# EAGLE design Base_Station (EAGLE 6.5.0)
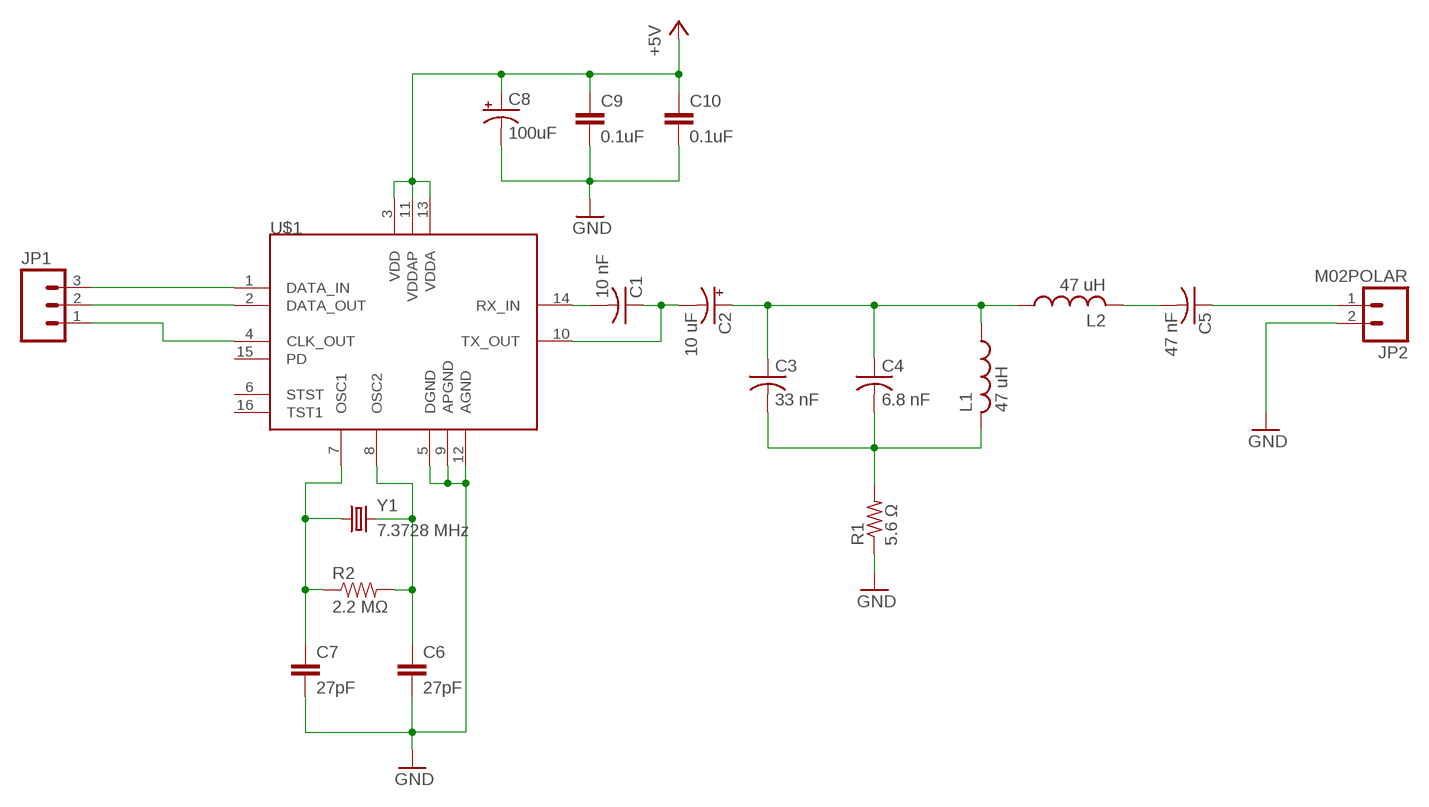
[diagram p0: schematic, sheet 1]

## Parts
C1  10 nF  C-US025-030X050  [C025-030X050]
C2  10 uF  CPOL-USE2-5  [E2-5]
C3  33 nF  C-US050-050X075  [C050-050X075]
C4  6.8 nF  C-US102-043X133  [C102-043X133]
C5  47 nF  C-US075-063X106  [C075-063X106]
C6  27pF  CAPPTH1  [CAP-PTH-5MM]
C7  27pF  CAPPTH1  [CAP-PTH-5MM]
C8  100uF  CAP_POLPTH1  [CPOL-RADIAL-100UF-25V]
C9  0.1uF  CAPPTH1  [CAP-PTH-5MM]
C10  0.1uF  CAPPTH1  [CAP-PTH-5MM]
JP1  M03POLAR  [MOLEX-1X3]
JP2  M02POLAR  [MOLEX-1X2]
L1  47 uH  L-US0204/7  [0204/7]
L2  47 uH  L-US0207/10  [0207/10]
R1  5.6 Ω  R-US_0207/7  [0207/7]
R2  2.2 MΩ  RESISTORPTH-1/4W  [AXIAL-0.4]
U$1  TDA5052AT  [SO16L]
Y1  7.3728 MHz  CRYSTALHC49US  [HC49US]

## Nets
+5V: C8.1(+) C9.1 C10.1 U$1.3(VDD) U$1.11(VDDAP) U$1.13(VDDA)
GND: C6.2 C7.2 C8.2(-) C9.2 C10.2 JP2.2 R1.1 U$1.5(DGND) U$1.9(APGND) U$1.12(AGND)
N$1: C1.2 U$1.14(RX_IN)
N$2: C5.2 L2.2
N$3: C1.1 C2.- U$1.10(TX_OUT)
N$4: C2.+ C3.1 C4.1 L1.1 L2.1
N$5: C3.2 C4.2 L1.2 R1.2
N$6: C5.1 JP2.1
N$7: C7.1 R2.P$1 U$1.7(OSC1) Y1.1
N$8: C6.1 R2.P$2 U$1.8(OSC2) Y1.2
N$9: JP1.3 U$1.1(DATA_IN)
N$10: JP1.2 U$1.2(DATA_OUT)
N$11: JP1.1 U$1.4(CLK_OUT)
Unconnected: U$1.6(STST) U$1.15(PD) U$1.16(TST1)

## Library data of the parts
C1 C3-C5 = rcl:C-US: CAPACITOR, American symbol
C2 = rcl:CPOL-US: POLARIZED CAPACITOR, American symbol
C6 C7 = SparkFun-Passives:CAP: Capacitor Standard 0603 ceramic capacitor, and 0.1" leaded capacitor.
C8 = SparkFun-Capacitors:CAP_POL: Capacitor Polarized These are standard SMD and PTH capacitors. Normally 10uF, 47uF, and 100uF in electrolytic and tantalum varieties. Always verify the external diameter of the through hole cap, it varies with capacity, voltage, and manufacturer. The EIA devices should be standard.
C9 C10 = SparkFun-Capacitors:CAP: Capacitor Standard 0603 ceramic capacitor, and 0.1" leaded capacitor.
JP1 = SparkFun-Connectors:M03: Header 3 Standard 3-pin 0.1" header. Use with straight break away headers (SKU : PRT-00116), right angle break away headers (PRT-00553), swiss pins (PRT-00743), machine pins (PRT-00117), and female headers (PRT-00115). Molex polarized connector foot print use with SKU : PRT-08232 with associated crimp pins and housings.
JP2 = SparkFun-Connectors:M02: Standard 2-pin 0.1" header. Use with - straight break away headers ( PRT-00116) - right angle break away headers (PRT-00553) - swiss pins (PRT-00743) - machine pins (PRT-00117) - female headers (PRT-00115) Molex polarized connector foot print use with: PRT-08233 with associated crimp pins and housings. 2.54_SCREWTERM for use with PRT-10571. 3.5mm Screw Terminal footprints for PRT-08084 5mm Screw Terminal footprints for use with PRT-08433
L1 L2 = rcl:L-US: INDUCTOR, American symbol
R1 = rcl:R-US_: RESISTOR, American symbol
R2 = SparkFun-Passives:RESISTOR: Resistor Basic schematic elements and footprints for 0603, 1206, and PTH resistors.
U$1 = Power_Modem:TDA5052AT
Y1 = SparkFun-FreqCtrl:CRYSTAL: Various standard crystals. Proven footprints. Spark Fun Electronics SKU : COM-00534

## Board
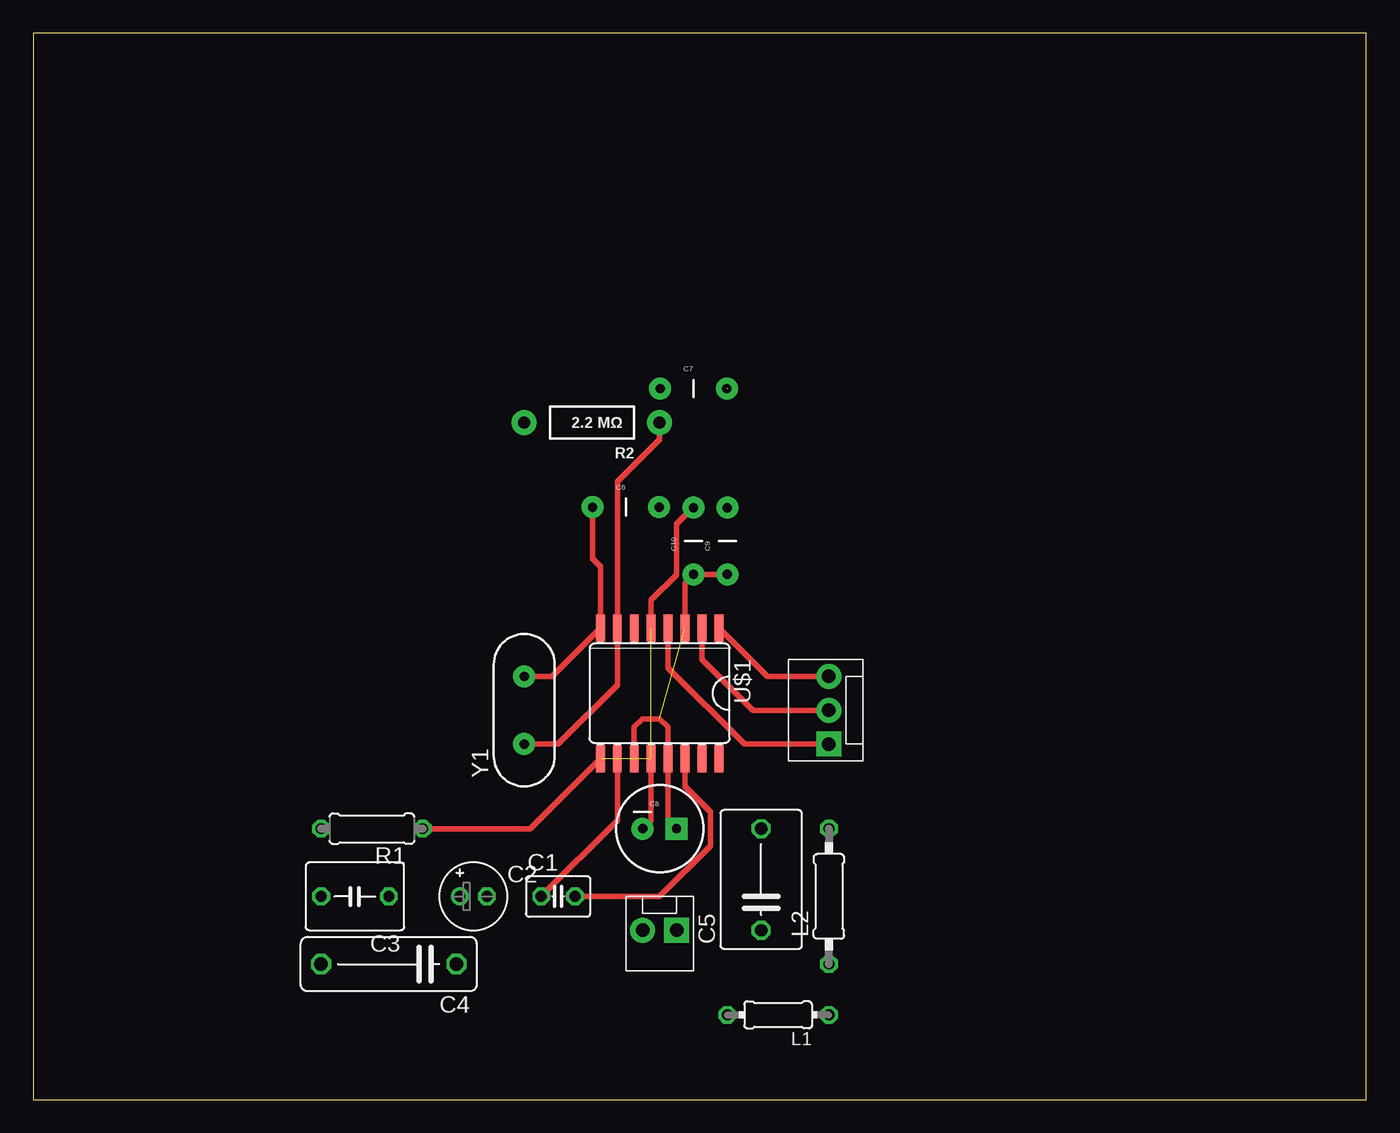
[diagram p1: board, top side]
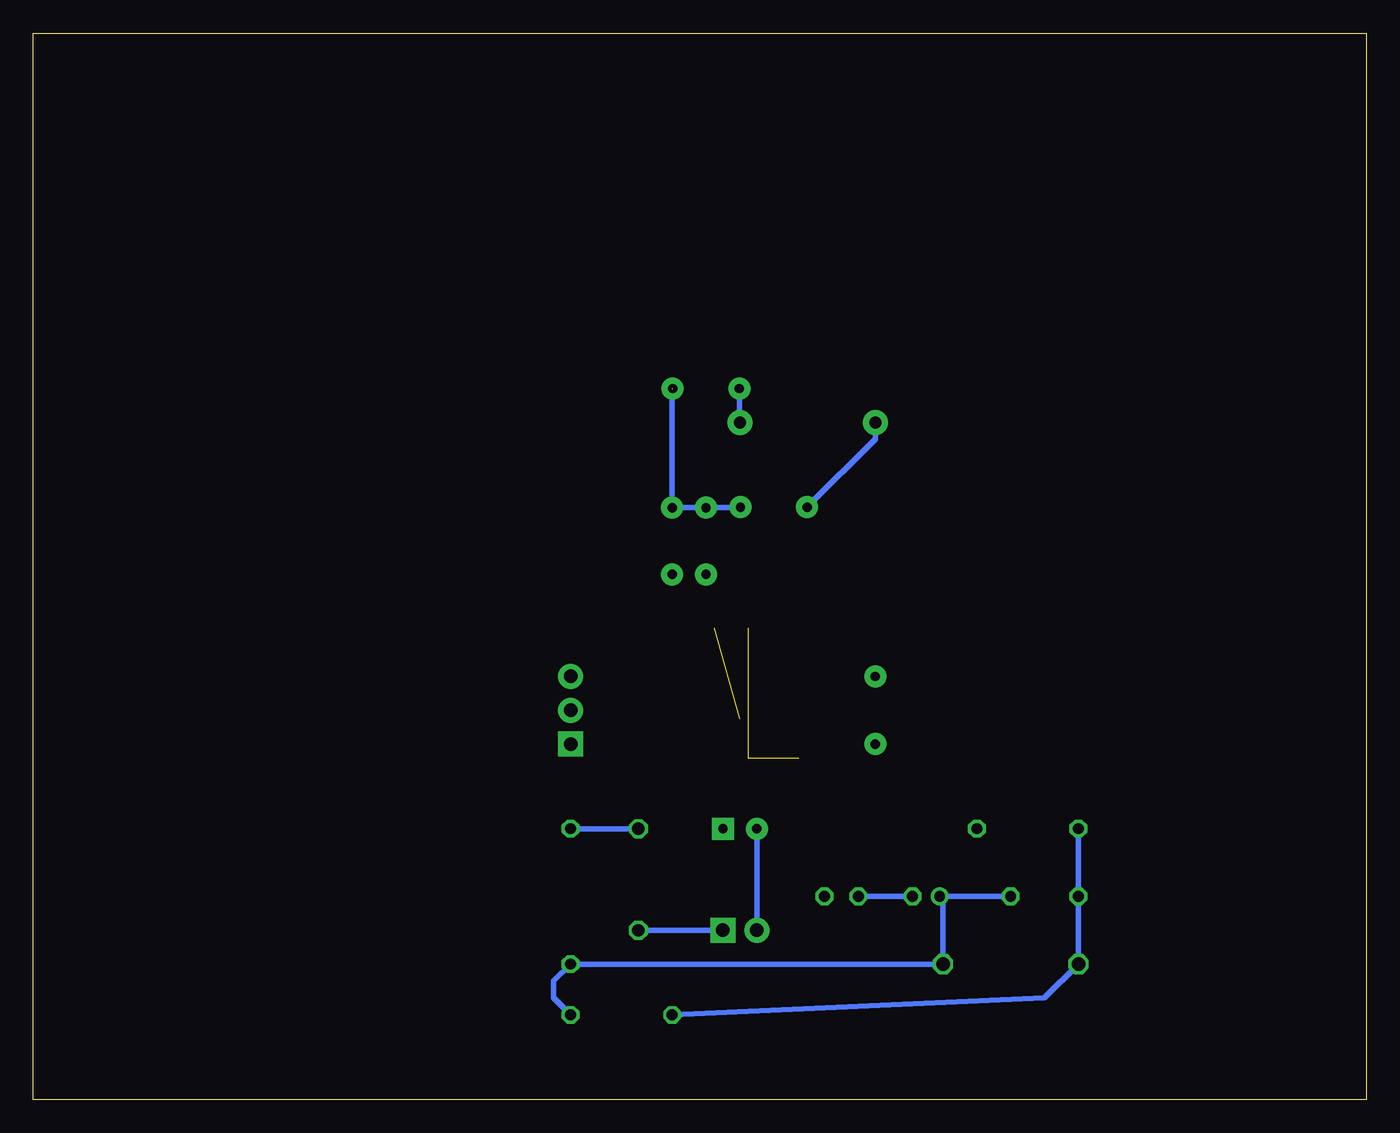
[diagram p2: board, bottom side, seen from below]

Size 100 x 80 mm. Coordinates in mm from the lower left corner, seen from the top.
Outline: 0,0 100,0 100,80 0,80 0,0
Copper layers (1*16): Top 0.035mm / dielectric 1.5mm / Bottom 0.035mm
Design rules "default": minimum track width 10mil, minimum drill 24mil, track to track 8mil, track to pad 8mil, pad to pad 8mil, via to via 8mil, smd to smd 8mil, copper to edge 40mil, drill to drill 8mil, minimum pad ring 10mil, minimum via ring 8mil, stop-mask expansion 4mil, vias tented up to drill 0mil, thermal gap 10mil

### Footprints (pad centres in the part's own frame; a part is rotated, then mirrored left to right if it is on the bottom)
C025-030X050 = drill 0.813 octagon: 1 -1.27,0; 2 1.27,0
E2-5 = drill 0.813 pad 1.27: + -1.016,0 | drill 0.813 pad 1.27 octagon: - 1.016,0
C050-050X075 = drill 0.813 octagon: 1 -2.54,0; 2 2.54,0
C102-043X133 = drill 1.016 octagon: 1 -5.08,0; 2 5.08,0
C075-063X106 = drill 0.914 octagon: 1 -3.81,0; 2 3.81,0
CAP-PTH-5MM = drill 0.7 pad 1.651: 1 -2.5,0; 2 2.5,0
CPOL-RADIAL-100UF-25V = drill 0.7 pad 1.651 square: 1 1.27,0 | drill 0.7 pad 1.651: 2 -1.27,0
MOLEX-1X3 = drill 1.016 pad 1.88 square: 1 0,0 | drill 1.016 pad 1.88: 2 2.54,0; 3 5.08,0
MOLEX-1X2 = drill 1.016 pad 1.88 square: 1 0,0 | drill 1.016 pad 1.88: 2 2.54,0
0204/7 = drill 0.813 octagon: 1 -3.81,0; 2 3.81,0
0207/10 = drill 0.813 octagon: 1 -5.08,0; 2 5.08,0
0207/7 = drill 0.813 octagon: 1 -3.81,0; 2 3.81,0
AXIAL-0.4 = drill 0.9 pad 1.88: P$1 -5.08,0; P$2 5.08,0
SO16L = smd 0.66 x 2.032: 1 -4.445,-4.902; 2 -3.175,-4.902; 3 -1.905,-4.902; 4 -0.635,-4.902; 5 0.635,-4.902; 6 1.905,-4.902; 7 3.175,-4.902; 8 4.445,-4.902; 9 4.445,4.902; 10 3.175,4.902; 11 1.905,4.902; 12 0.635,4.902; 13 -0.635,4.902; 14 -1.905,4.902; 15 -3.175,4.902; 16 -4.445,4.902
HC49US = drill 0.7 pad 1.651: 1 -2.54,0; 2 2.54,0

### Placement (x,y rotation side)
C1  39.37,15.24 0 top
C2  33.02,15.24 0 top
C3  24.13,15.24 180 top
C4  26.67,10.16 180 top
C5  54.61,16.51 90 top
C6  44.45,44.45 0 top
C7  49.53,53.34 0 top
C8  46.99,20.32 0 top
C9  52.07,41.91 90 top
C10  49.53,41.91 90 top
JP1  59.69,26.67 90 top
JP2  48.26,12.7 180 top
L1  55.88,6.35 180 top
L2  59.69,15.24 90 top
R1  25.4,20.32 180 top
R2  41.91,50.8 180 top
U$1  46.99,30.48 180 top
Y1  36.83,29.21 90 top

### Tracks (layer width: path | path; a pad name or v marks a point on that pad's centre or on a via)
+5V  (1 unrouted)
  Top 0.406: C9.1 C10.1 49.53,39.37 48.9,38.73 U$1.3 | C8.1 47.62,20.95 U$1.13 47.62,27.94 46.99,28.57 45.72,28.57 45.09,27.94 U$1.11
GND  (3 unrouted)
  Top 0.406: U$1.5 46.35,37.47 48.26,39.37 48.26,43.18 49.49,44.41 C10.2 | U$1.12 46.35,20.95 C8.2 | U$1.9 37.29,20.32 R1.1
  Bottom 0.406: C8.2 JP2.2 | 52.07,53.34 C9.2 C10.2 46.99,44.41 C6.2
N$1
  Top 0.406: C1.2 46.99,15.24 50.8,19.05 50.8,21.59 48.9,23.5 U$1.14
N$2
  Bottom 0.406: C5.2 L2.2
N$3
  Top 0.406: U$1.10 43.81,20.95 C1.1
  Bottom 0.406: C2.- C1.1
N$4
  Bottom 0.406: C3.1 31.75,15.24 | C2.+ 31.75,15.24 | 31.75,15.24 C4.1 L2.1 60.96,8.89 60.96,7.62 L1.1
N$5
  Bottom 0.406: L1.2 24.13,7.62 C4.2 C3.2 R1.2
N$6
  Bottom 0.406: JP2.1 C5.1
N$7
  Top 0.406: R2.P$1 46.99,49.53 43.81,46.35 U$1.7 43.81,31.11 39.37,26.67 Y1.1
  Bottom 0.406: R2.P$1 47.03,50.84 C7.1
N$8
  Top 0.406: C6.1 41.95,40.6 42.55,40.01 U$1.8 38.91,31.75 Y1.2
  Bottom 0.406: C6.1 36.83,49.57 R2.P$2
N$9
  Top 0.406: U$1.1 55.07,31.75 JP1.3
N$10
  Top 0.406: U$1.2 50.16,33.02 53.98,29.21 JP1.2
N$11
  Top 0.406: U$1.4 47.62,32.38 53.34,26.67 JP1.1